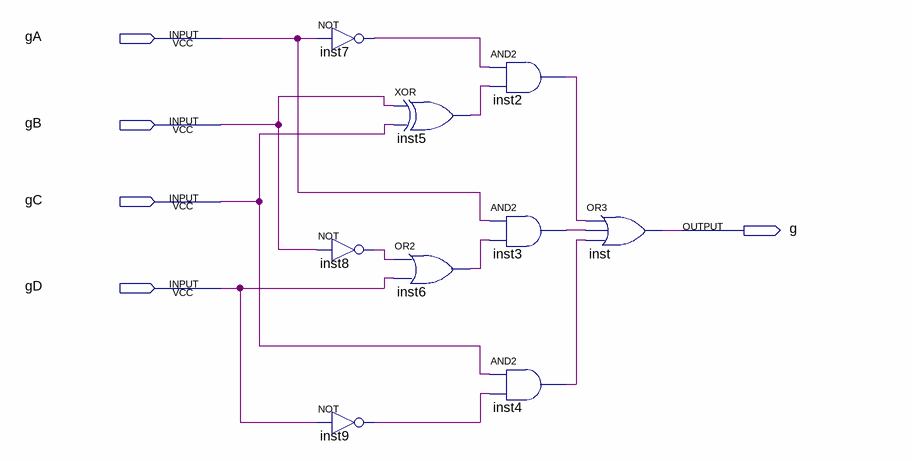
[diagram p0: schematic sheet]
// Quartus schematic segmentoG.bdf as structural Verilog: 9 symbols, 5 pins
module segmentoG (
  input  gA,
  input  gB,
  input  gC,
  input  gD,
  output g
);

  wire inst2_out, inst3_out, inst4_out, inst5_out, inst6_out, inst7_out, inst8_out, inst9_out;

  not inst7 (inst7_out, gA);
  not inst8 (inst8_out, gB);
  not inst9 (inst9_out, gD);
  xor inst5 (inst5_out, gB, gC);
  or inst6 (inst6_out, inst8_out, gD);
  and inst2 (inst2_out, inst7_out, inst5_out);
  and inst3 (inst3_out, gA, inst6_out);
  and inst4 (inst4_out, gC, inst9_out);
  or inst (g, inst2_out, inst3_out, inst4_out);
endmodule
